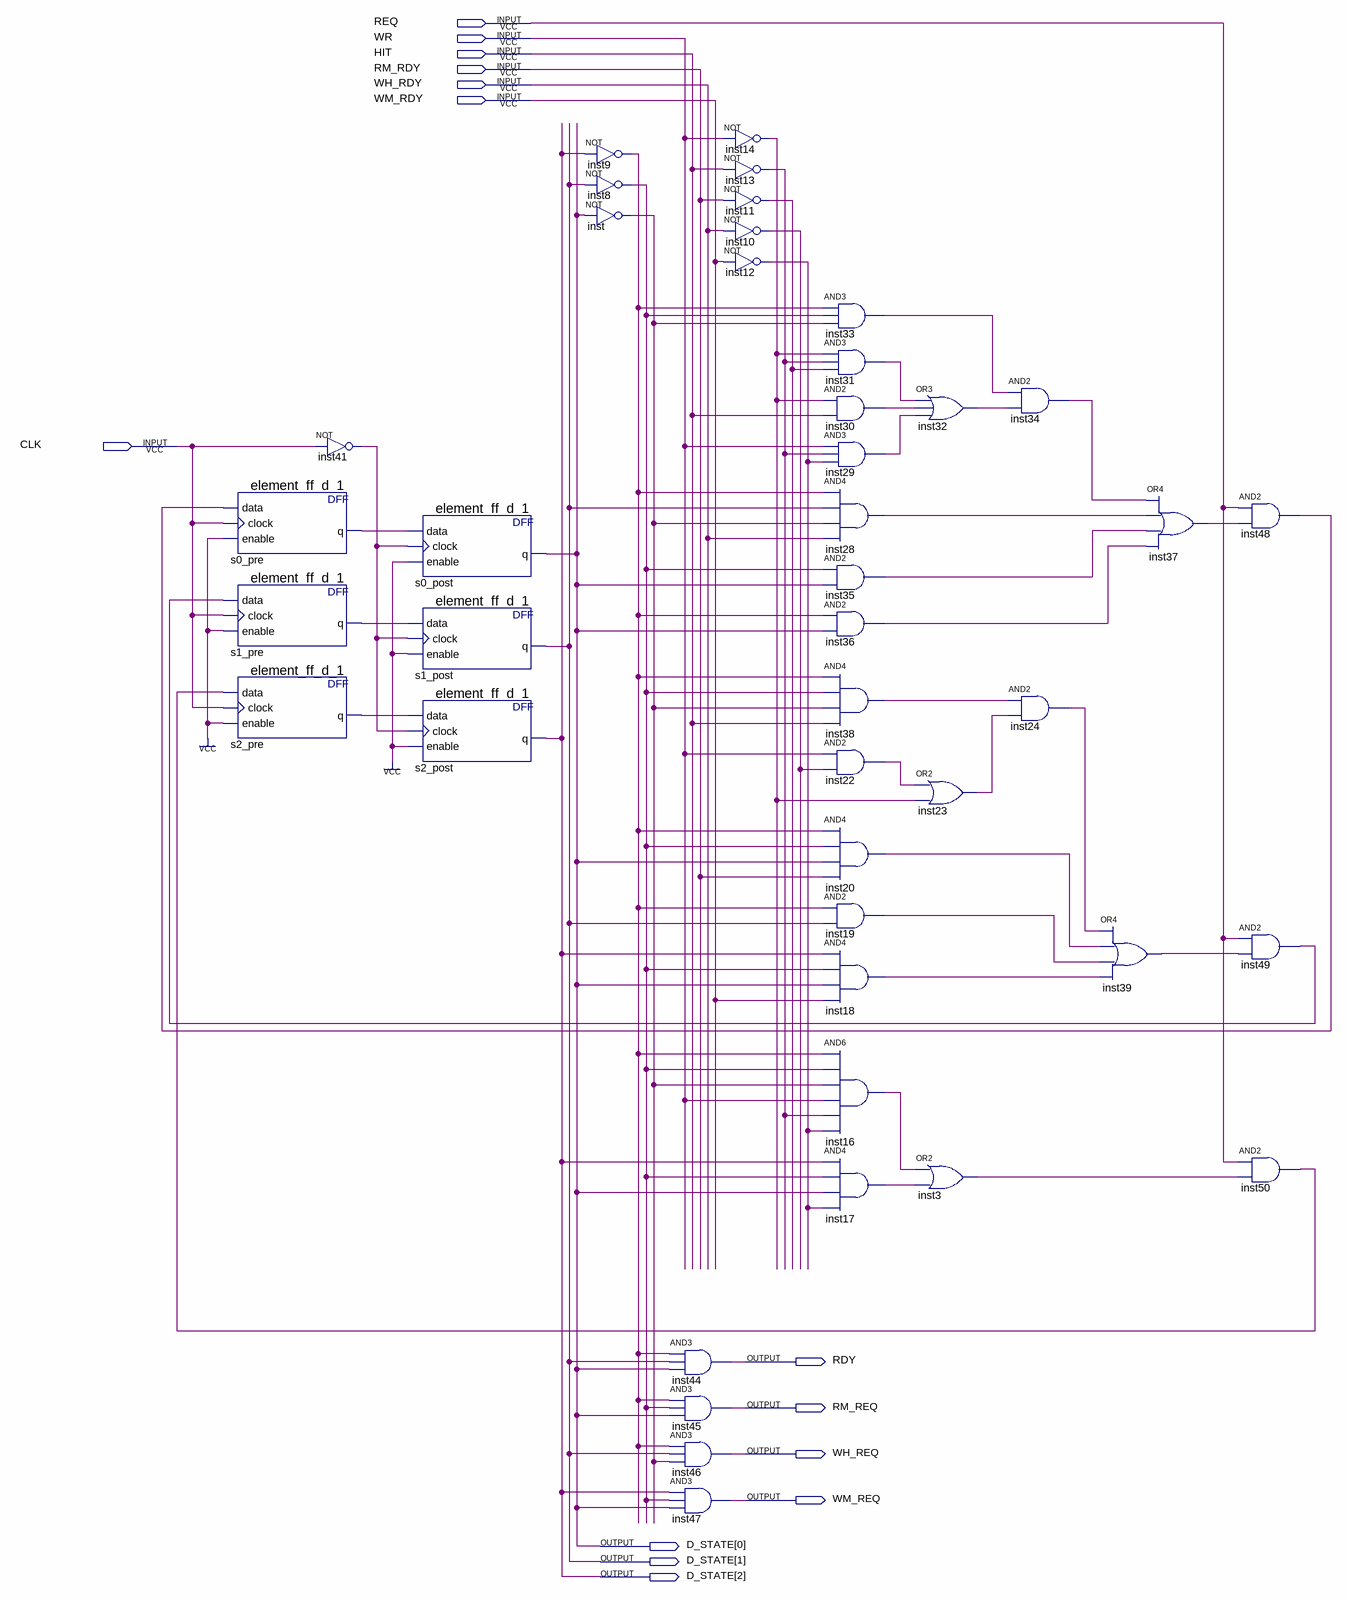
[diagram p0: schematic sheet]
// Quartus schematic block-data-cache-state-machine-main.bdf as structural Verilog: 43 symbols, 14 pins
module \block-data-cache-state-machine-main  (
  input  REQ,
  input  WR,
  input  HIT,
  input  RM_RDY,
  input  WH_RDY,
  input  WM_RDY,
  input  CLK,
  output RDY,
  output RM_REQ,
  output WH_REQ,
  output WM_REQ,
  output [2:0] D_STATE
);

  wire inst3_out, inst8_out, inst9_out, inst10_out, inst11_out, inst12_out, inst13_out, inst14_out,
       inst16_out, inst17_out, inst18_out, inst19_out, inst20_out, inst22_out, inst23_out, inst24_out,
       inst28_out, inst29_out, inst30_out, inst31_out, inst32_out, inst33_out, inst34_out, inst35_out,
       inst36_out, inst37_out, inst38_out, inst39_out, inst41_out, inst48_out, inst49_out, inst50_out,
       inst_out, s0_pre_q, s1_pre_q, s2_pre_q;

  element_ff_d_1 s0_pre (.data(inst48_out), .clock(CLK), .enable(1'b1), .q(s0_pre_q));
  element_ff_d_1 s1_pre (.data(inst49_out), .clock(CLK), .enable(1'b1), .q(s1_pre_q));
  element_ff_d_1 s2_pre (.data(inst50_out), .clock(CLK), .enable(1'b1), .q(s2_pre_q));
  not inst41 (inst41_out, CLK);
  element_ff_d_1 s0_post (.data(s0_pre_q), .clock(inst41_out), .enable(1'b1), .q(D_STATE[0]));
  element_ff_d_1 s1_post (.data(s1_pre_q), .clock(inst41_out), .enable(1'b1), .q(D_STATE[1]));
  element_ff_d_1 s2_post (.data(s2_pre_q), .clock(inst41_out), .enable(1'b1), .q(D_STATE[2]));
  not inst9 (inst9_out, D_STATE[2]);
  not inst8 (inst8_out, D_STATE[1]);
  not inst (inst_out, D_STATE[0]);
  and inst44 (RDY, inst9_out, D_STATE[1], D_STATE[0]);
  and inst45 (RM_REQ, inst9_out, inst8_out, D_STATE[0]);
  and inst46 (WH_REQ, inst9_out, D_STATE[1], inst_out);
  and inst47 (WM_REQ, D_STATE[2], inst8_out, D_STATE[0]);
  not inst14 (inst14_out, WR);
  not inst13 (inst13_out, HIT);
  not inst11 (inst11_out, RM_RDY);
  not inst10 (inst10_out, WH_RDY);
  not inst12 (inst12_out, WM_RDY);
  and inst33 (inst33_out, inst9_out, inst8_out, inst_out);
  and inst31 (inst31_out, inst14_out, inst13_out, inst11_out);
  and inst30 (inst30_out, inst14_out, HIT);
  and inst29 (inst29_out, WR, inst13_out, inst12_out);
  and inst28 (inst28_out, inst9_out, D_STATE[1], inst_out, WH_RDY);
  and inst35 (inst35_out, inst8_out, D_STATE[0]);
  and inst36 (inst36_out, inst9_out, D_STATE[0]);
  and inst38 (inst38_out, inst9_out, inst8_out, inst_out, HIT);
  and inst22 (inst22_out, WR, inst10_out);
  and inst20 (inst20_out, inst9_out, inst8_out, D_STATE[0], RM_RDY);
  and inst19 (inst19_out, inst9_out, D_STATE[1]);
  and inst18 (inst18_out, D_STATE[2], inst8_out, D_STATE[0], WM_RDY);
  and inst16 (inst16_out, inst9_out, inst8_out, inst_out, WR, inst13_out, inst12_out);
  and inst17 (inst17_out, D_STATE[2], inst8_out, D_STATE[0], inst12_out);
  or inst32 (inst32_out, inst31_out, inst30_out, inst29_out);
  or inst23 (inst23_out, inst22_out, inst14_out);
  or inst3 (inst3_out, inst16_out, inst17_out);
  and inst34 (inst34_out, inst33_out, inst32_out);
  and inst24 (inst24_out, inst38_out, inst23_out);
  or inst39 (inst39_out, inst24_out, inst20_out, inst19_out, inst18_out);
  or inst37 (inst37_out, inst34_out, inst28_out, inst35_out, inst36_out);
  and inst48 (inst48_out, REQ, inst37_out);
  and inst49 (inst49_out, REQ, inst39_out);
  and inst50 (inst50_out, REQ, inst3_out);
endmodule
